# EAGLE design minimallogic (EAGLE 6.6.0)
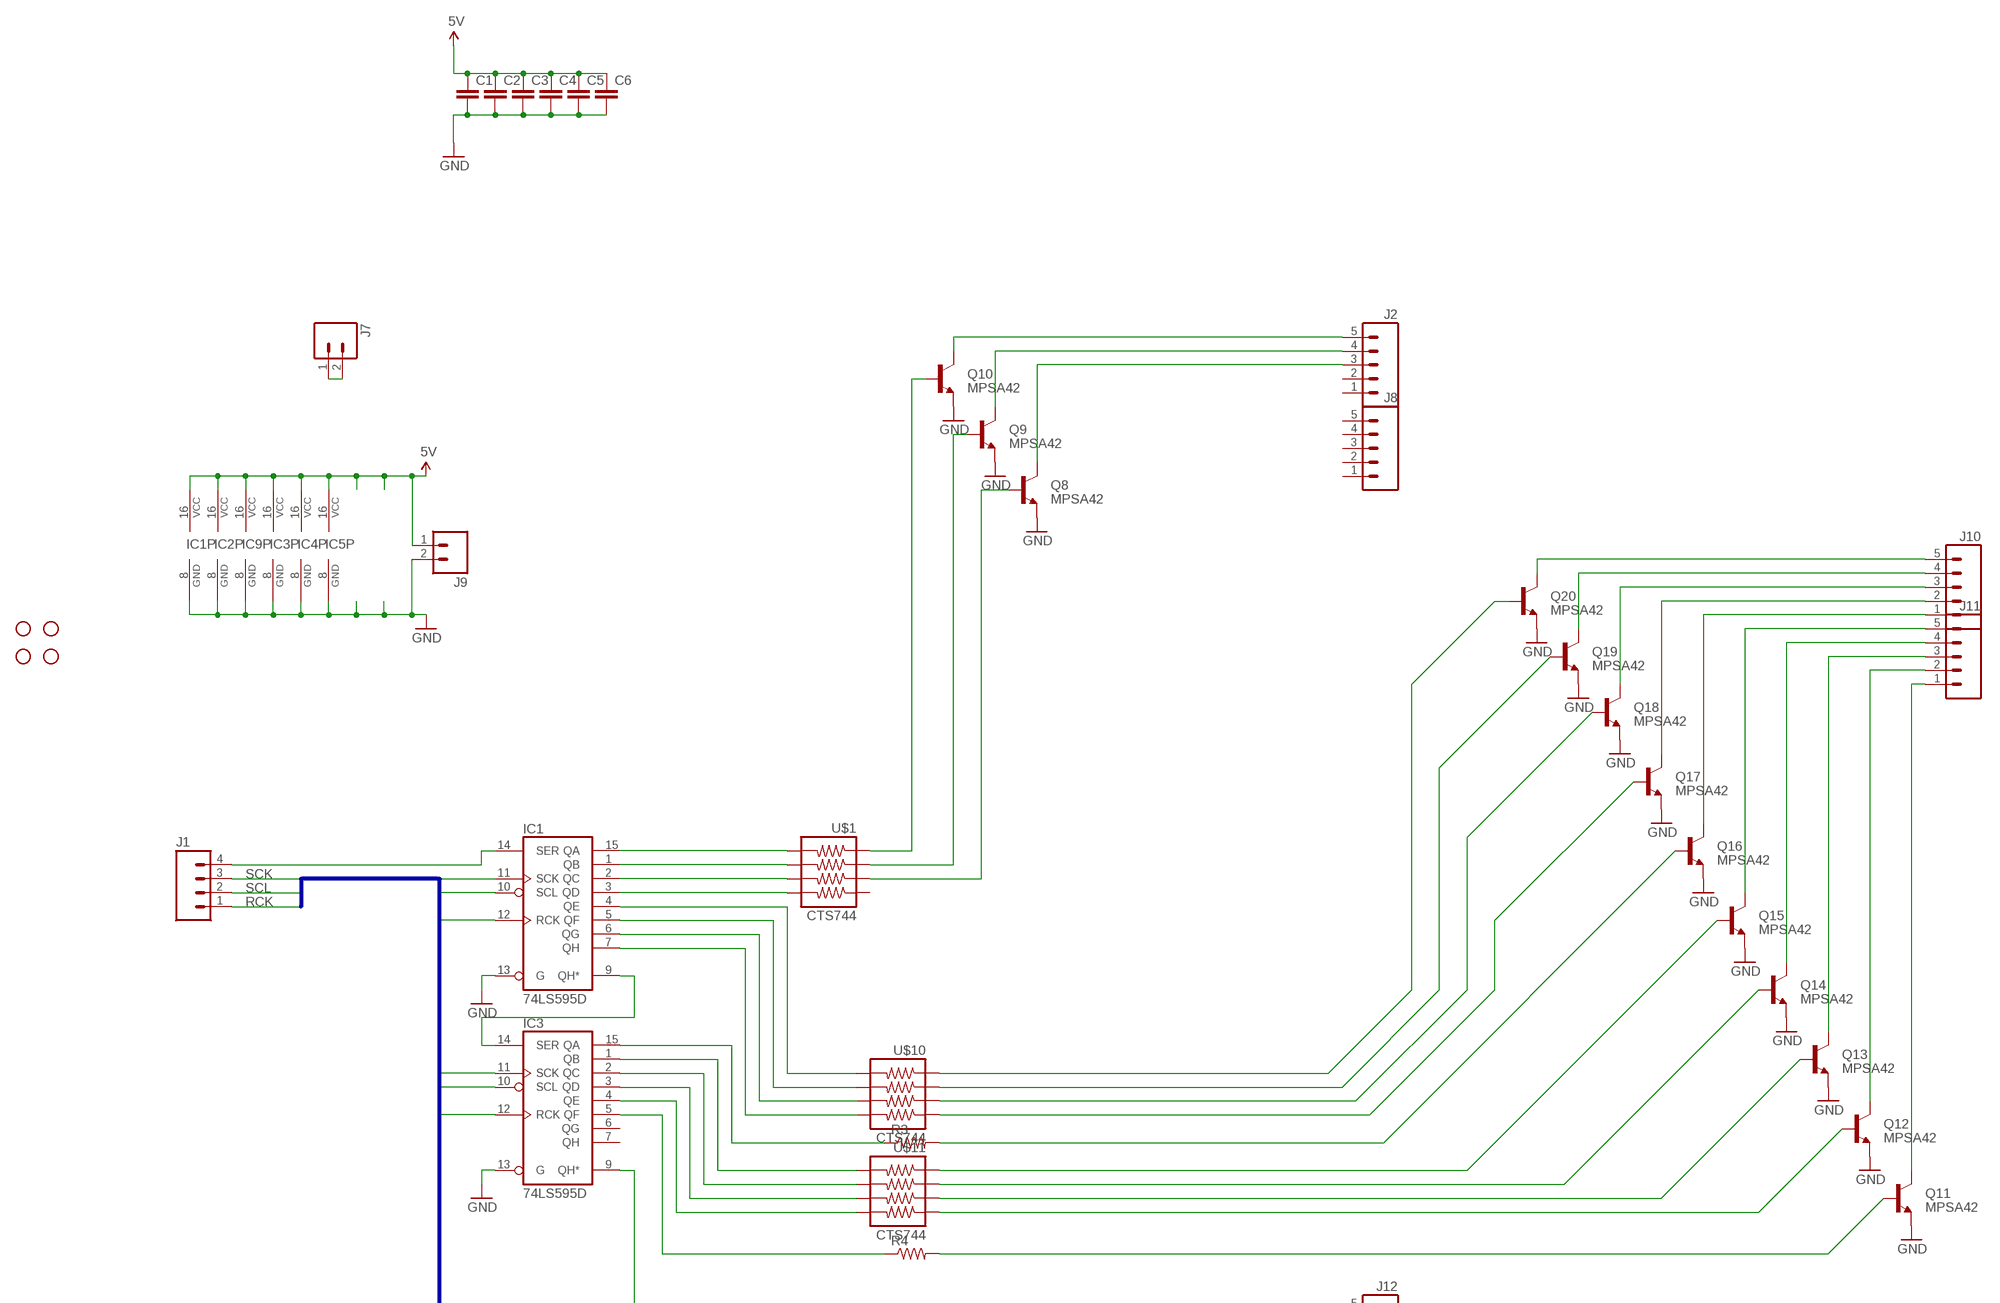
[diagram p0: schematic, sheet 1, part 1 of 2]
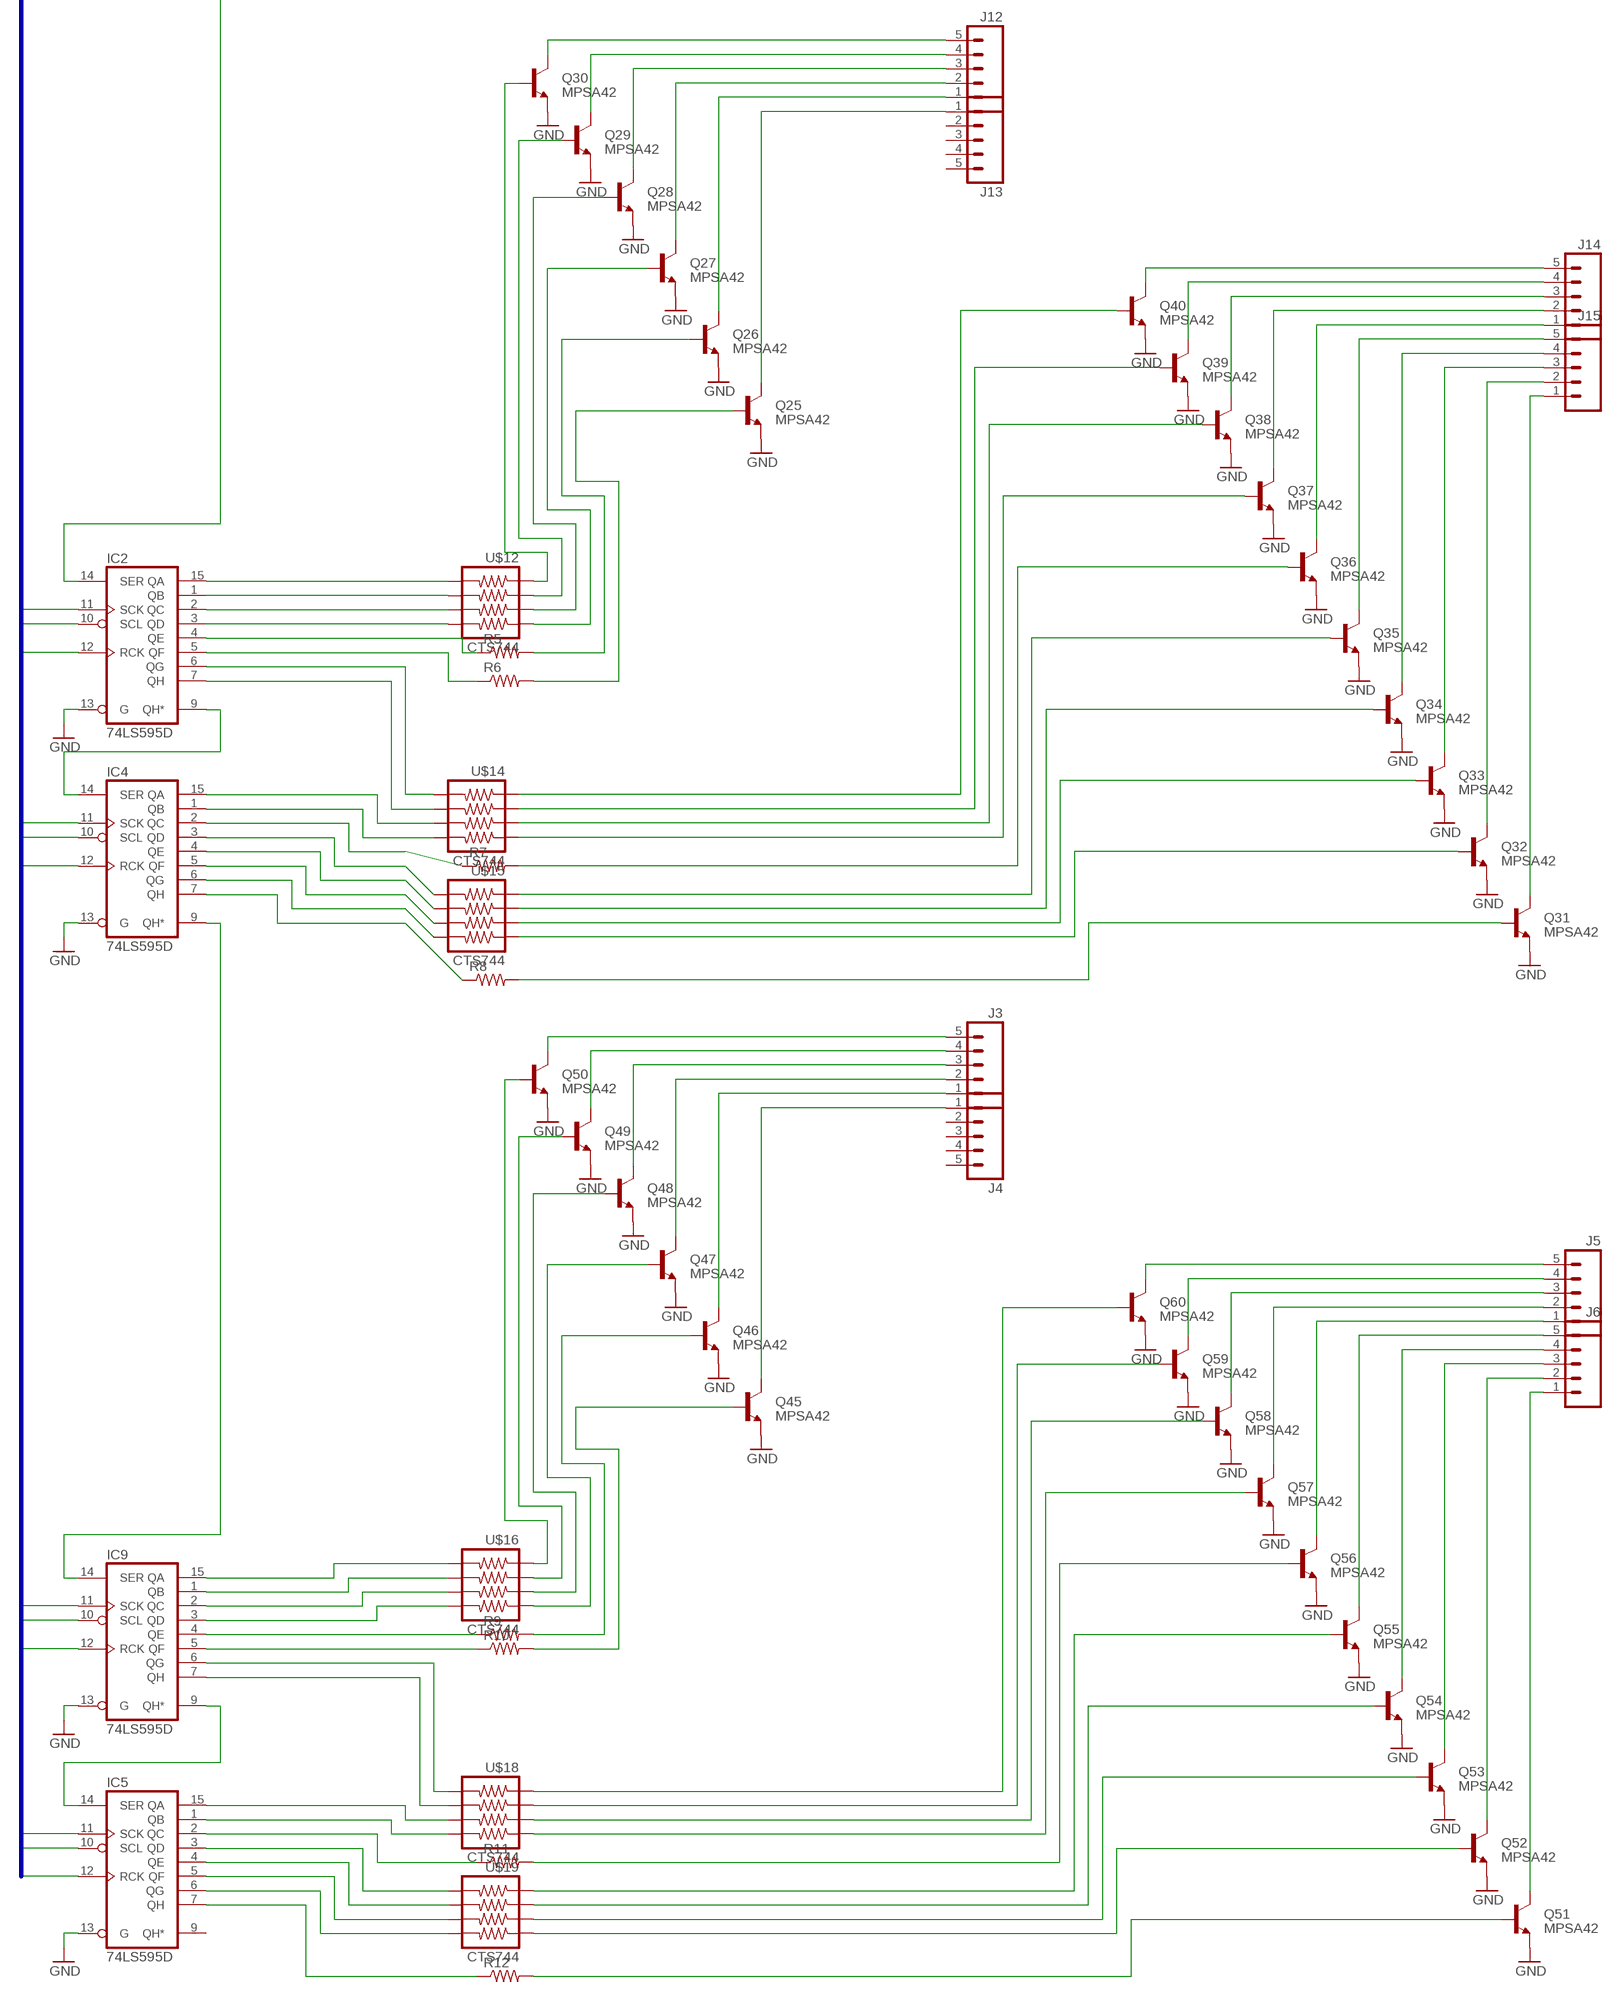
[diagram p1: schematic, sheet 1, part 2 of 2]

## Parts
C1  CAP0805  [0805]
C2  CAP0805  [0805]
C3  CAP0805  [0805]
C4  CAP0805  [0805]
C5  CAP0805  [0805]
C6  CAP0805  [0805]
H1  STAND-OFF  [STAND-OFF]
H2  STAND-OFF  [STAND-OFF]
H3  STAND-OFF  [STAND-OFF]
H4  STAND-OFF  [STAND-OFF]
IC1  74LS595D  [SO16]
IC2  74LS595D  [SO16]
IC3  74LS595D  [SO16]
IC4  74LS595D  [SO16]
IC5  74LS595D  [SO16]
IC9  74LS595D  [SO16]
J1  M04PTH  [1X04]
J2  M05PTH  [1X05]
J3  M05PTH  [1X05]
J4  M05PTH  [1X05]
J5  M05PTH  [1X05]
J6  M05PTH  [1X05]
J7  M02PTH  [1X02]
J8  M05PTH  [1X05]
J9  M02PTH  [1X02]
J10  M05PTH  [1X05]
J11  M05PTH  [1X05]
J12  M05PTH  [1X05]
J13  M05PTH  [1X05]
J14  M05PTH  [1X05]
J15  M05PTH  [1X05]
Q8  MPSA42  TRANSISTOR_NPNMPSA42  [SOT23-3]
Q9  MPSA42  TRANSISTOR_NPNMPSA42  [SOT23-3]
Q10  MPSA42  TRANSISTOR_NPNMPSA42  [SOT23-3]
Q11  MPSA42  TRANSISTOR_NPNMPSA42  [SOT23-3]
Q12  MPSA42  TRANSISTOR_NPNMPSA42  [SOT23-3]
Q13  MPSA42  TRANSISTOR_NPNMPSA42  [SOT23-3]
Q14  MPSA42  TRANSISTOR_NPNMPSA42  [SOT23-3]
Q15  MPSA42  TRANSISTOR_NPNMPSA42  [SOT23-3]
Q16  MPSA42  TRANSISTOR_NPNMPSA42  [SOT23-3]
Q17  MPSA42  TRANSISTOR_NPNMPSA42  [SOT23-3]
Q18  MPSA42  TRANSISTOR_NPNMPSA42  [SOT23-3]
Q19  MPSA42  TRANSISTOR_NPNMPSA42  [SOT23-3]
Q20  MPSA42  TRANSISTOR_NPNMPSA42  [SOT23-3]
Q25  MPSA42  TRANSISTOR_NPNMPSA42  [SOT23-3]
Q26  MPSA42  TRANSISTOR_NPNMPSA42  [SOT23-3]
Q27  MPSA42  TRANSISTOR_NPNMPSA42  [SOT23-3]
Q28  MPSA42  TRANSISTOR_NPNMPSA42  [SOT23-3]
Q29  MPSA42  TRANSISTOR_NPNMPSA42  [SOT23-3]
Q30  MPSA42  TRANSISTOR_NPNMPSA42  [SOT23-3]
Q31  MPSA42  TRANSISTOR_NPNMPSA42  [SOT23-3]
Q32  MPSA42  TRANSISTOR_NPNMPSA42  [SOT23-3]
Q33  MPSA42  TRANSISTOR_NPNMPSA42  [SOT23-3]
Q34  MPSA42  TRANSISTOR_NPNMPSA42  [SOT23-3]
Q35  MPSA42  TRANSISTOR_NPNMPSA42  [SOT23-3]
Q36  MPSA42  TRANSISTOR_NPNMPSA42  [SOT23-3]
Q37  MPSA42  TRANSISTOR_NPNMPSA42  [SOT23-3]
Q38  MPSA42  TRANSISTOR_NPNMPSA42  [SOT23-3]
Q39  MPSA42  TRANSISTOR_NPNMPSA42  [SOT23-3]
Q40  MPSA42  TRANSISTOR_NPNMPSA42  [SOT23-3]
Q45  MPSA42  TRANSISTOR_NPNMPSA42  [SOT23-3]
Q46  MPSA42  TRANSISTOR_NPNMPSA42  [SOT23-3]
Q47  MPSA42  TRANSISTOR_NPNMPSA42  [SOT23-3]
Q48  MPSA42  TRANSISTOR_NPNMPSA42  [SOT23-3]
Q49  MPSA42  TRANSISTOR_NPNMPSA42  [SOT23-3]
Q50  MPSA42  TRANSISTOR_NPNMPSA42  [SOT23-3]
Q51  MPSA42  TRANSISTOR_NPNMPSA42  [SOT23-3]
Q52  MPSA42  TRANSISTOR_NPNMPSA42  [SOT23-3]
Q53  MPSA42  TRANSISTOR_NPNMPSA42  [SOT23-3]
Q54  MPSA42  TRANSISTOR_NPNMPSA42  [SOT23-3]
Q55  MPSA42  TRANSISTOR_NPNMPSA42  [SOT23-3]
Q56  MPSA42  TRANSISTOR_NPNMPSA42  [SOT23-3]
Q57  MPSA42  TRANSISTOR_NPNMPSA42  [SOT23-3]
Q58  MPSA42  TRANSISTOR_NPNMPSA42  [SOT23-3]
Q59  MPSA42  TRANSISTOR_NPNMPSA42  [SOT23-3]
Q60  MPSA42  TRANSISTOR_NPNMPSA42  [SOT23-3]
R3  RESISTOR0805-RES  [0805]
R4  RESISTOR0805-RES  [0805]
R5  RESISTOR0805-RES  [0805]
R6  RESISTOR0805-RES  [0805]
R7  RESISTOR0805-RES  [0805]
R8  RESISTOR0805-RES  [0805]
R9  RESISTOR0805-RES  [0805]
R10  RESISTOR0805-RES  [0805]
R11  RESISTOR0805-RES  [0805]
R12  RESISTOR0805-RES  [0805]
U$1  CTS744  [CT740-746]
U$10  CTS744  [CT740-746]
U$11  CTS744  [CT740-746]
U$12  CTS744  [CT740-746]
U$14  CTS744  [CT740-746]
U$15  CTS744  [CT740-746]
U$16  CTS744  [CT740-746]
U$18  CTS744  [CT740-746]
U$19  CTS744  [CT740-746]

## Nets
5V: C1.1 C2.1 C3.1 C4.1 C5.1 C6.1 IC1.16(VCC) IC2.16(VCC) IC3.16(VCC) IC4.16(VCC) IC5.16(VCC) IC9.16(VCC) J9.1
GND: C1.2 C2.2 C3.2 C4.2 C5.2 C6.2 IC1.8(GND) IC1.13(G) IC2.8(GND) IC2.13(G) IC3.8(GND) IC3.13(G) IC4.8(GND) IC4.13(G) IC5.8(GND) IC5.13(G) IC9.8(GND) IC9.13(G) J9.2 Q8.2(E) Q9.2(E) Q10.2(E) Q11.2(E) Q12.2(E) Q13.2(E) Q14.2(E) Q15.2(E) Q16.2(E) Q17.2(E) Q18.2(E) Q19.2(E) Q20.2(E) Q25.2(E) Q26.2(E) Q27.2(E) Q28.2(E) Q29.2(E) Q30.2(E) Q31.2(E) Q32.2(E) Q33.2(E) Q34.2(E) Q35.2(E) Q36.2(E) Q37.2(E) Q38.2(E) Q39.2(E) Q40.2(E) Q45.2(E) Q46.2(E) Q47.2(E) Q48.2(E) Q49.2(E) Q50.2(E) Q51.2(E) Q52.2(E) Q53.2(E) Q54.2(E) Q55.2(E) Q56.2(E) Q57.2(E) Q58.2(E) Q59.2(E) Q60.2(E)
N$1: IC1.4(QE) U$10.P8(OUT1)
N$2: IC1.5(QF) U$10.P7(OUT2)
N$3: IC1.6(QG) U$10.P6(OUT3)
N$4: IC1.7(QH) U$10.P5(OUT4)
N$5: IC2.5(QF) R6.1
N$6: IC2.4(QE) R5.1
N$7: IC2.9(QH*) IC4.14(SER)
N$8: IC9.15(QA) U$16.P8(OUT1)
N$9: J13.1 Q25.3(C)
N$10: J12.1 Q26.3(C)
N$11: J11.1 Q11.3(C)
N$12: J11.2 Q12.3(C)
N$13: J11.3 Q13.3(C)
N$14: J11.4 Q14.3(C)
N$15: J11.5 Q15.3(C)
N$16: J10.1 Q16.3(C)
N$17: J10.2 Q17.3(C)
N$18: J10.3 Q18.3(C)
N$19: J10.4 Q19.3(C)
N$20: J10.5 Q20.3(C)
N$21: IC1.9(QH*) IC3.14(SER)
N$22: IC1.15(QA) U$1.P8(OUT1)
N$23: IC1.1(QB) U$1.P7(OUT2)
N$24: IC1.2(QC) U$1.P6(OUT3)
N$25: IC1.3(QD) U$1.P5(OUT4)
N$26: IC3.15(QA) R3.1
N$27: IC3.1(QB) U$11.P8(OUT1)
N$28: IC3.2(QC) U$11.P7(OUT2)
N$29: IC3.3(QD) U$11.P6(OUT3)
N$30: IC3.4(QE) U$11.P5(OUT4)
N$31: IC3.5(QF) R4.1
N$32: IC9.1(QB) U$16.P7(OUT2)
N$33: IC9.2(QC) U$16.P6(OUT3)
N$34: IC9.3(QD) U$16.P5(OUT4)
N$35: IC9.4(QE) R9.1
N$36: IC9.5(QF) R10.1
N$37: IC2.15(QA) U$12.P8(OUT1)
N$38: IC2.1(QB) U$12.P7(OUT2)
N$39: IC2.2(QC) U$12.P6(OUT3)
N$40: IC2.3(QD) U$12.P5(OUT4)
N$41: IC5.14(SER) IC9.9(QH*)
N$42: J12.2 Q27.3(C)
N$43: IC4.9(QH*) IC9.14(SER)
N$44: IC9.6(QG) U$18.P8(OUT1)
N$45: IC9.7(QH) U$18.P7(OUT2)
N$46: IC5.15(QA) U$18.P6(OUT3)
N$47: IC2.6(QG) U$14.P8(OUT1)
N$48: IC2.7(QH) U$14.P7(OUT2)
N$49: IC4.15(QA) U$14.P6(OUT3)
N$50: IC4.1(QB) U$14.P5(OUT4)
N$51: IC4.2(QC) R7.1
N$52: IC4.3(QD) U$15.P8(OUT1)
N$53: IC4.4(QE) U$15.P7(OUT2)
N$54: IC4.5(QF) U$15.P6(OUT3)
N$55: IC4.6(QG) U$15.P5(OUT4)
N$56: IC4.7(QH) R8.1
N$57: IC5.1(QB) U$18.P5(OUT4)
N$58: IC5.2(QC) R11.1
N$59: IC5.3(QD) U$19.P8(OUT1)
N$60: IC5.4(QE) U$19.P7(OUT2)
N$61: Q20.1(B) U$10.P1(IN1)
N$62: IC5.5(QF) U$19.P6(OUT3)
N$63: IC5.6(QG) U$19.P5(OUT4)
N$64: IC5.7(QH) R12.1
N$65: J4.1 Q45.3(C)
N$66: J3.1 Q46.3(C)
N$67: J3.2 Q47.3(C)
N$68: J7.1 J7.2
N$69: Q11.1(B) R4.2
N$71: J12.3 Q28.3(C)
N$72: J12.4 Q29.3(C)
N$73: Q12.1(B) U$11.P4(IN4)
N$74: J12.5 Q30.3(C)
N$75: Q13.1(B) U$11.P3(IN3)
N$77: Q14.1(B) U$11.P2(IN2)
N$86: Q15.1(B) U$11.P1(IN1)
N$87: Q16.1(B) R3.2
N$89: Q19.1(B) U$10.P2(IN2)
N$90: Q18.1(B) U$10.P3(IN3)
N$91: Q17.1(B) U$10.P4(IN4)
N$92: Q10.1(B) U$1.P1(IN1)
N$93: Q9.1(B) U$1.P2(IN2)
N$94: Q8.1(B) U$1.P3(IN3)
N$98: J15.1 Q31.3(C)
N$99: J15.2 Q32.3(C)
N$100: J15.3 Q33.3(C)
N$101: J15.4 Q34.3(C)
N$102: J15.5 Q35.3(C)
N$103: J14.1 Q36.3(C)
N$104: J14.2 Q37.3(C)
N$105: J14.3 Q38.3(C)
N$106: J14.4 Q39.3(C)
N$107: J14.5 Q40.3(C)
N$111: Q30.1(B) U$12.P1(IN1)
N$112: Q29.1(B) U$12.P2(IN2)
N$113: Q28.1(B) U$12.P3(IN3)
N$114: Q27.1(B) U$12.P4(IN4)
N$115: Q26.1(B) R5.2
N$116: Q25.1(B) R6.2
N$144: IC2.14(SER) IC3.9(QH*)
N$152: J2.3 Q8.3(C)
N$153: J2.4 Q9.3(C)
N$154: J2.5 Q10.3(C)
N$157: Q40.1(B) U$14.P1(IN1)
N$158: Q39.1(B) U$14.P2(IN2)
N$159: Q38.1(B) U$14.P3(IN3)
N$160: Q37.1(B) U$14.P4(IN4)
N$161: Q36.1(B) R7.2
N$162: Q35.1(B) U$15.P1(IN1)
N$163: Q34.1(B) U$15.P2(IN2)
N$164: Q33.1(B) U$15.P3(IN3)
N$165: Q32.1(B) U$15.P4(IN4)
N$166: Q31.1(B) R8.2
N$167: Q50.1(B) U$16.P1(IN1)
N$168: Q49.1(B) U$16.P2(IN2)
N$169: Q48.1(B) U$16.P3(IN3)
N$170: Q47.1(B) U$16.P4(IN4)
N$171: Q46.1(B) R9.2
N$172: Q45.1(B) R10.2
N$177: Q60.1(B) U$18.P1(IN1)
N$178: Q59.1(B) U$18.P2(IN2)
N$179: Q58.1(B) U$18.P3(IN3)
N$180: Q57.1(B) U$18.P4(IN4)
N$181: Q56.1(B) R11.2
N$182: Q55.1(B) U$19.P1(IN1)
N$183: Q54.1(B) U$19.P2(IN2)
N$184: Q53.1(B) U$19.P3(IN3)
N$185: Q52.1(B) U$19.P4(IN4)
N$186: Q51.1(B) R12.2
N$187: IC1.14(SER) J1.4
N$198: J3.3 Q48.3(C)
N$199: J3.4 Q49.3(C)
N$200: J3.5 Q50.3(C)
N$221: J6.1 Q51.3(C)
N$222: J6.2 Q52.3(C)
N$223: J6.3 Q53.3(C)
N$224: J6.4 Q54.3(C)
N$225: J6.5 Q55.3(C)
N$226: J5.1 Q56.3(C)
N$227: J5.2 Q57.3(C)
N$228: J5.3 Q58.3(C)
N$229: J5.4 Q59.3(C)
N$230: J5.5 Q60.3(C)
RCK: IC1.12(RCK) IC2.12(RCK) IC3.12(RCK) IC4.12(RCK) IC5.12(RCK) IC9.12(RCK) J1.1
SCK: IC1.11(SCK) IC2.11(SCK) IC3.11(SCK) IC4.11(SCK) IC5.11(SCK) IC9.11(SCK) J1.3
SCL: IC1.10(SCL) IC2.10(SCL) IC3.10(SCL) IC4.10(SCL) IC5.10(SCL) IC9.10(SCL) J1.2
Unconnected: IC3.6(QG) IC3.7(QH) IC5.9(QH*) J2.1 J2.2 J4.2 J4.3 J4.4 J4.5 J8.1 J8.2 J8.3 J8.4 J8.5 J13.2 J13.3 J13.4 J13.5 U$1.P4(IN4)

## Buses
SCK,SCL,RCK

## Library data of the parts
C1-C6 = SparkFun-Capacitors:CAP: Capacitor Standard 0603 ceramic capacitor, and 0.1" leaded capacitor.
H1-H4 = SparkFun-Electromechanical:STAND-OFF: #4 Stand Off This is the mechanical footprint for a #4 phillips button head screw. Use the keepout ring to avoid running the screw head into surrounding components. SKU : PRT-00447
IC1-IC5 IC9 = 74xx-us:74*595: 8-bit SHIFT REGISTER, output latch
J1 = SparkFun-Connectors:M04: Header 4 Standard 4-pin 0.1" header. Use with straight break away headers (SKU : PRT-00116), right angle break away headers (PRT-00553), swiss pins (PRT-00743), machine pins (PRT-00117), and female headers (PRT-00115). Molex polarized connector foot print use with SKU : PRT-08231 with associated crimp pins and housings. 1MM SMD Version SKU: PRT-10208; PROD_ID: CONN-09696
J2-J6 J8 J10-J15 = SparkFun-Connectors:M05: Header 5 Standard 5-pin 0.1" header. Use with straight break away headers (SKU : PRT-00116), right angle break away headers (PRT-00553), swiss pins (PRT-00743), machine pins (PRT-00117), and female headers (PRT-00115). Molex polarized connector foot print use with SKU : PRT-08230 with associated crimp pins and housings.
J7 J9 = SparkFun-Connectors:M02: Standard 2-pin 0.1" header. Use with - straight break away headers ( PRT-00116) - right angle break away headers (PRT-00553) - swiss pins (PRT-00743) - machine pins (PRT-00117) - female headers (PRT-00115) Molex polarized connector foot print use with: PRT-08233 with associated crimp pins and housings. 2.54_SCREWTERM for use with PRT-10571. 3.5mm Screw Terminal footprints for PRT-08084 5mm Screw Terminal footprints for use with PRT-08432
Q8-Q20 Q25-Q40 Q45-Q60 = SparkFun-DiscreteSemi:TRANSISTOR_NPN: Generic NPN BJT MMBT2222A - TRANS-08049 (SOT-23, 1A 40V) MPSA42 - TRANS-09116 (SOT-23, 500mA 300V) MMBT5088LT1G - TRANS-11160 (SOT-23, 50 mA 30V) BC547 - COM-08928 <http://www.sparkfun.com/products/8928> (TO-92 45V 100mA) (1.Collector 2.Base 3.Emitter) 2N3904 - COM-00521 <http://www.sparkfun.com/products/521> (TO-92 40V 200mA) (1.Emitter 2.Base 3.Collector) P2N2222A - COM-12852 <http://www.sparkfun.com/products/12852> (TO-92 40V 600mA) (1.Collector 2.Base 3.Emitter); PROD_ID: TRANS-09116
R3-R12 = SparkFun-Passives:RESISTOR: Resistor Basic schematic elements and footprints for 0603, 1206, and PTH resistors.
U$1 U$10-U$12 U$14-U$16 U$18 U$19 = SparkFun-Passives:CTS744

## Board
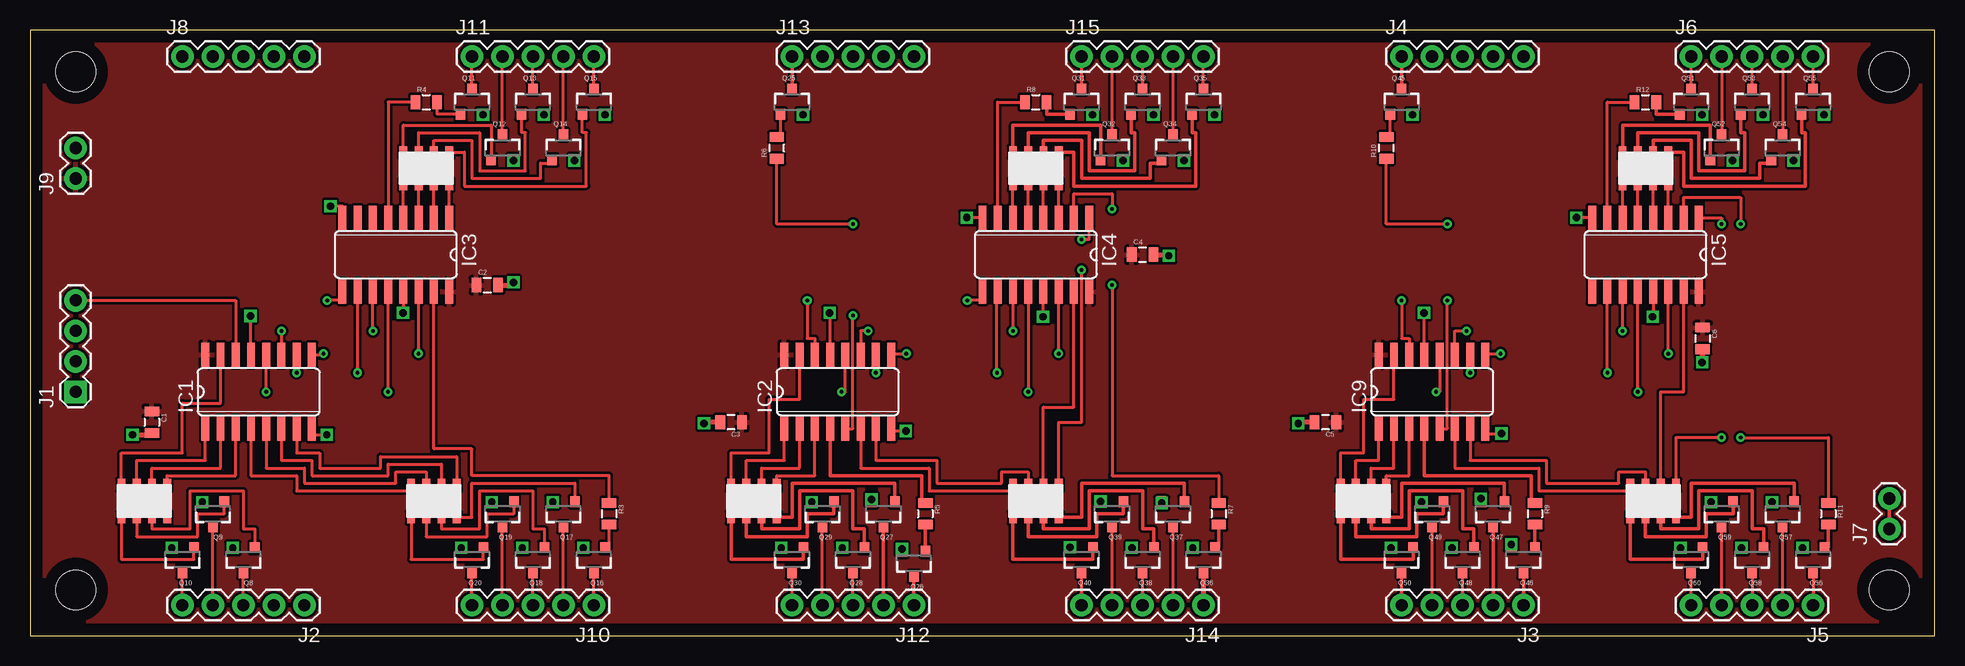
[diagram p2: board, top side]
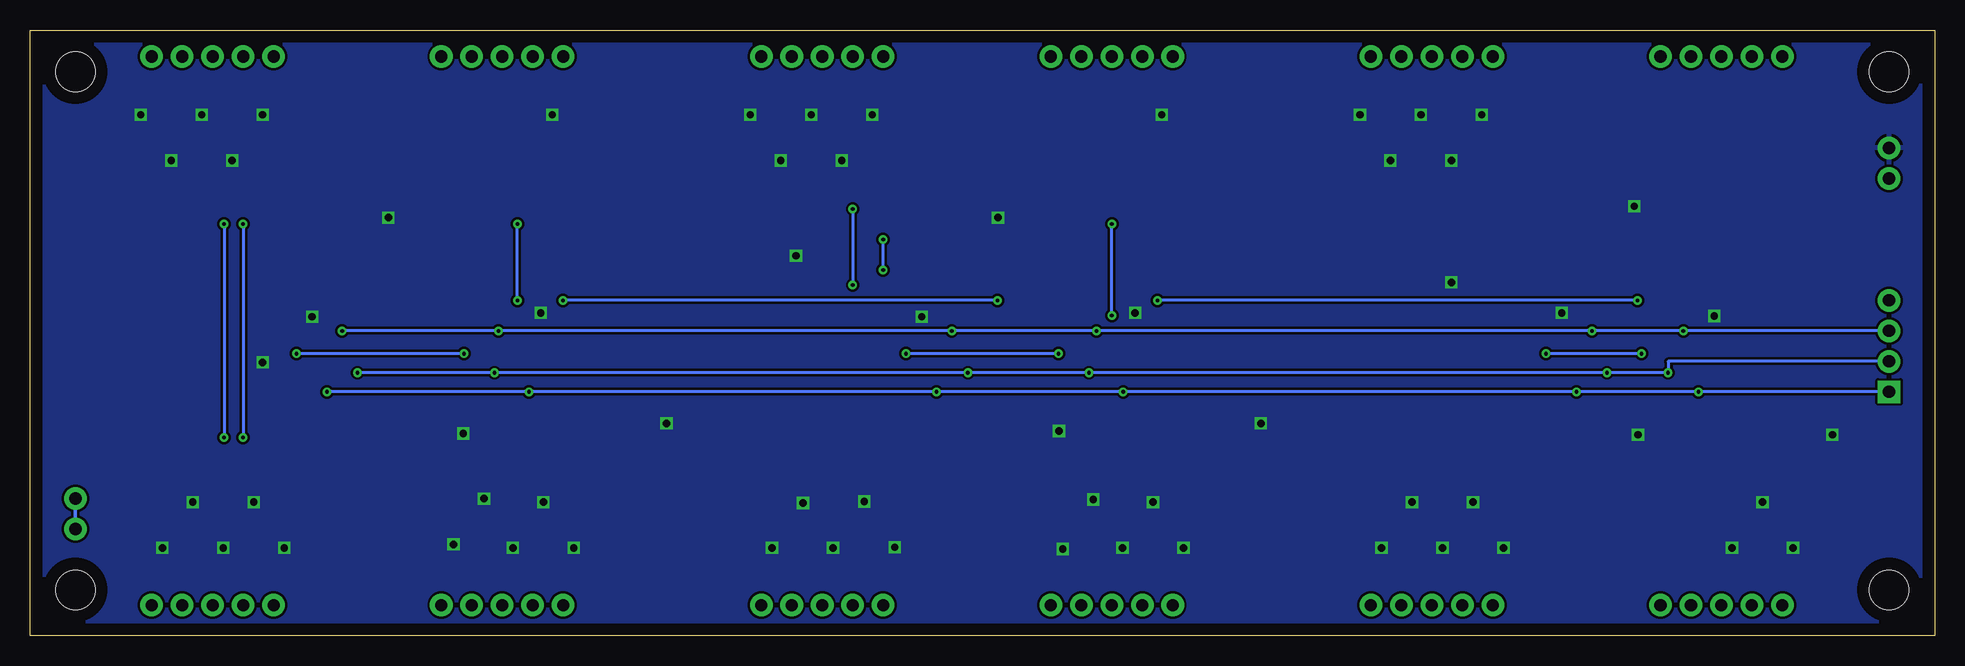
[diagram p3: board, bottom side, seen from below]

Size 158.73 x 50.47 mm. Coordinates in mm from the lower left corner, seen from the top.
Outline: 0,0 158.73,0 158.73,50.47 0,50.47 0,0
Copper layers (1*16): Top 0.035mm / dielectric 1.5mm / Bottom 0.035mm
Design rules "default *": minimum track width 10mil, minimum drill 12mil, track to track 8mil, track to pad 8mil, pad to pad 8mil, via to via 8mil, smd to smd 8mil, copper to edge 40mil, drill to drill 8mil, minimum pad ring 10mil, minimum via ring 8mil, stop-mask expansion 4mil, vias tented up to drill 0mil, thermal gap 10mil

### Footprints (pad centres in the part's own frame; a part is rotated, then mirrored left to right if it is on the bottom)
0805 = smd 0.8 x 1.2: 1 -0.9,0; 2 0.9,0
STAND-OFF = hole 3.302: 0,0
SO16 = smd 0.66 x 2.032: 1 -4.445,-3.073; 2 -3.175,-3.073; 3 -1.905,-3.073; 4 -0.635,-3.073; 5 0.635,-3.073; 6 1.905,-3.073; 7 3.175,-3.073; 8 4.445,-3.073; 9 4.445,3.073; 10 3.175,3.073; 11 1.905,3.073; 12 0.635,3.073; 13 -0.635,3.073; 14 -1.905,3.073; 15 -3.175,3.073; 16 -4.445,3.073
1X04 = drill 1.016 pad 1.88 square: 1 0,0 | drill 1.016 pad 1.88: 2 2.54,0; 3 5.08,0; 4 7.62,0
1X05 = drill 1.016 pad 1.88: 1 0,0; 2 2.54,0; 3 5.08,0; 4 7.62,0; 5 10.16,0
1X02 = drill 1.016 pad 1.88: 1 0,0; 2 2.54,0
SOT23-3 = smd 0.8 x 0.9: 1 -0.95,-1; 2 0.95,-1; 3 0,1.1
CT740-746 = smd 0.65 x 1: P1 0,-2.2; P2 1.27,-2.2; P3 2.54,-2.2; P4 3.81,-2.2; P5 3.81,0.5; P6 2.54,0.5; P7 1.27,0.5; P8 0,0.5

### Placement (x,y rotation side)
C1  10.16,17.78 270 top
C2  38.1,29.21 0 top
C3  58.42,17.78 180 top
C4  92.71,31.75 0 top
C5  107.95,17.78 180 top
C6  139.38,24.77 270 top
H1  3.81,3.81 0 top
H2  154.94,46.99 0 top
H3  154.94,3.81 0 top
H4  3.81,46.99 0 top
IC1  19.05,20.32 0 top
IC2  67.31,20.32 0 top
IC3  30.48,31.75 180 top
IC4  83.82,31.75 180 top
IC5  134.62,31.75 180 top
IC9  116.84,20.32 0 top
J1  3.81,20.32 90 top
J2  22.86,2.54 180 top
J3  124.46,2.54 180 top
J4  114.3,48.26 0 top
J5  148.59,2.54 180 top
J6  138.43,48.26 0 top
J7  154.94,8.89 90 top
J8  12.7,48.26 0 top
J9  3.81,38.1 90 top
J10  46.99,2.54 180 top
J11  36.83,48.26 0 top
J12  73.66,2.54 180 top
J13  63.5,48.26 0 top
J14  97.79,2.54 180 top
J15  87.63,48.26 0 top
Q8  17.78,6.35 180 top
Q9  15.24,10.16 180 top
Q10  12.7,6.35 180 top
Q11  36.83,44.45 0 top
Q12  39.37,40.64 0 top
Q13  41.91,44.45 0 top
Q14  44.45,40.64 0 top
Q15  46.99,44.45 0 top
Q16  46.99,6.35 180 top
Q17  44.45,10.16 180 top
Q18  41.91,6.35 180 top
Q19  39.37,10.16 180 top
Q20  36.83,6.35 180 top
Q25  63.5,44.45 0 top
Q26  73.66,6.03 180 top
Q27  71.12,10.16 180 top
Q28  68.58,6.35 180 top
Q29  66.04,10.16 180 top
Q30  63.5,6.35 180 top
Q31  87.63,44.45 0 top
Q32  90.17,40.64 0 top
Q33  92.71,44.45 0 top
Q34  95.25,40.64 0 top
Q35  97.79,44.45 0 top
Q36  97.79,6.35 180 top
Q37  95.25,10.16 180 top
Q38  92.71,6.35 180 top
Q39  90.17,10.16 180 top
Q40  87.63,6.35 180 top
Q45  114.3,44.45 0 top
Q46  124.46,6.35 180 top
Q47  121.92,10.16 180 top
Q48  119.38,6.35 180 top
Q49  116.84,10.16 180 top
Q50  114.3,6.35 180 top
Q51  138.43,44.45 0 top
Q52  140.97,40.64 0 top
Q53  143.51,44.45 0 top
Q54  146.05,40.64 0 top
Q55  148.59,44.45 0 top
Q56  148.59,6.35 180 top
Q57  146.05,10.16 180 top
Q58  143.51,6.35 180 top
Q59  140.97,10.16 180 top
Q60  138.43,6.35 180 top
R3  48.26,10.16 270 top
R4  33.02,44.45 0 top
R5  74.61,10.16 270 top
R6  62.23,40.64 90 top
R7  99.06,10.16 270 top
R8  83.82,44.45 0 top
R9  125.41,10.16 270 top
R10  113.03,40.64 90 top
R11  149.86,10.16 270 top
R12  134.62,44.45 0 top
U$1  7.62,12.06 0 top
U$10  31.75,12.06 0 top
U$11  34.92,38.1 180 top
U$12  58.42,12.06 0 top
U$14  81.92,12.06 0 top
U$15  85.73,38.1 180 top
U$16  109.22,12.06 0 top
U$18  133.35,12.06 0 top
U$19  136.53,38.1 180 top

### Tracks (layer width: path | path; a pad name or v marks a point on that pad's centre or on a via)
5V
  pour Top: 0,0 158.75,0 158.75,50.8 0,50.8
GND  (via drill 0.61)
  Top 0.254: IC1.8 23.49,16.74 v24.73,16.74 | IC1.13 18.41,26.63 v18.38,26.63 | IC2.8 71.75,17.06 v72.99,17.06 | IC2.13 66.67,26.9 v66.64,26.9 | IC9.8 121.28,16.84 v122.62,16.84 | IC3.13 31.11,26.9 v31.08,26.9 | IC3.8 26.04,35.79 v25.04,35.79 | IC9.13 116.2,26.9 v116.17,26.9 | IC5.13 135.25,26.58 v135.22,26.58 | IC5.8 128.87,34.82 v128.87,34.84 | v84.42,26.58 84.45,26.58 IC4.13 | v64.41,43.41 64.45,43.41 Q25.2 | Q45.2 115.21,43.45 v115.21,43.41 | IC4.8 78.07,34.82 v78.07,34.84
  Top 0.305: Q39.2 89.2,11.16 v89.2,11.18 | v94.31,11.05 v94.3,11.05 Q37.2 | v91.82,7.32 91.76,7.32 Q38.2 | Q40.2 86.67,7.35 v86.67,7.37 | v96.9,7.32 96.84,7.32 Q36.2 | v67.69,7.32 67.63,7.32 Q28.2 | v65.15,11.12 65.09,11.12 Q29.2 | Q30.2 62.61,7.35 v62.61,7.32 | v46.1,7.32 46.04,7.32 Q16.2 | v43.56,11.12 43.5,11.12 Q17.2 | v41.02,7.32 40.96,7.32 Q18.2 | v38.48,11.12 38.42,11.12 Q19.2 | v35.94,7.32 35.88,7.32 Q20.2 | v16.89,7.32 16.83,7.32 Q8.2 | v14.35,11.12 14.29,11.12 Q9.2 | v11.81,7.32 11.75,7.32 Q10.2 | Q26.2 72.71,7.21 v72.67,7.21 | Q27.2 70.17,11.34 v70.13,11.34 | Q46.2 123.51,7.61 v123.44,7.61 | v118.49,7.32 118.49,7.35 Q48.2 | v113.41,7.32 113.41,7.35 Q50.2 | v115.95,11.12 115.95,11.16 Q49.2 | Q47.2 120.97,11.42 v120.9,11.42 | v149.5,43.41 149.5,43.45 Q55.2 | Q53.2 144.46,43.41 v144.42,43.41 | Q54.2 147,39.6 v146.96,39.6 | v139.34,43.41 139.34,43.45 Q51.2 | v141.88,39.6 141.88,39.64 Q52.2 | Q57.2 145.1,11.12 v145.16,11.12 | Q56.2 147.64,7.32 v147.7,7.32 | v140.08,11.12 140.08,11.16 Q59.2 | Q58.2 142.56,7.32 v142.62,7.32 | v98.7,43.41 98.7,43.45 Q35.2 | v137.54,7.32 137.54,7.35 Q60.2 | v93.62,43.41 93.62,43.45 Q33.2 | v96.16,39.6 96.16,39.64 Q34.2 | v88.54,43.41 88.54,43.45 Q31.2 | v91.08,39.6 91.08,39.64 Q32.2 | v47.9,43.41 47.9,43.45 Q15.2 | v42.82,43.41 42.82,43.45 Q13.2 | Q14.2 45.4,39.6 v45.36,39.6 | v40.28,39.6 40.28,39.64 Q12.2 | v37.74,43.41 37.74,43.45 Q11.2
  Top 0.406: v8.53,16.74 10.16,16.74 C1.2 | C2.2 40.28,29.21 v40.28,29.44 | C3.2 56.16,17.78 v56.16,17.69 | C4.2 94.89,31.75 v94.89,31.66 | C5.2 105.69,17.78 v105.69,17.69 | C6.2 139.34,23.86 v139.34,22.77
  pour Bottom: 0,0 158.75,0 158.75,50.8 0,50.8
N$1
  Top 0.254: IC1.4 18.41,13.34 22.22,13.34 22.22,12.06 31.75,12.06 U$10.P8
N$2
  Top 0.254: IC1.5 19.68,13.97 22.86,13.97 22.86,12.7 30.48,12.7 30.48,13.65 33.02,13.65 U$10.P7
N$3
  Top 0.254: IC1.6 20.95,14.61 23.49,14.61 23.49,13.34 29.84,13.34 29.84,14.29 34.29,14.29 U$10.P6
N$4
  Top 0.254: IC1.7 22.22,15.24 24.13,15.24 24.13,13.97 29.21,13.97 29.21,14.92 35.56,14.92 U$10.P5
N$5  (via drill 0.3)
  Top 0.254: IC2.5 68.58,17.25 v68.58,26.67 | v68.58,34.29 62.23,34.29 R6.1
  Bottom 0.254: v68.58,26.67 v68.58,34.29
N$6
  Top 0.305: IC2.4 66.67,13.34 74.3,13.34 74.3,11.06 R5.1
N$7  (via drill 0.3)
  Top 0.254: IC2.9 71.75,23.5 v73.03,23.5 | v85.73,23.5 IC4.14
  Bottom 0.254: v73.03,23.5 v85.73,23.5
N$8
  Top 0.254: U$16.P8 109.22,15.24 111.12,15.24 111.12,19.68 113.67,19.68 IC9.15
N$9
  Top 0.305: Q25.3 J13.1
N$10
  Top 0.305: J12.1 Q26.3
N$11
  Top 0.254: Q11.3 J11.1
N$12
  Top 0.254: Q12.3 J11.2
N$13
  Top 0.254: Q13.3 J11.3
N$14
  Top 0.254: Q14.3 J11.4
N$15
  Top 0.254: Q15.3 J11.5
N$16
  Top 0.254: J10.1 Q16.3
N$17
  Top 0.254: J10.2 Q17.3
N$18
  Top 0.254: J10.3 Q18.3
N$19
  Top 0.254: J10.4 Q19.3
N$20
  Top 0.254: J10.5 Q20.3
N$21  (via drill 0.3)
  Top 0.254: IC1.9 24.45,23.39 v24.45,23.5 | v32.38,23.5 IC3.14
  Bottom 0.254: v24.45,23.5 v32.38,23.5
N$22
  Top 0.254: U$1.P8 7.62,15.24 12.7,15.24 12.7,19.37 15.88,19.37 IC1.15
N$23
  Top 0.254: U$1.P7 8.89,14.61 14.61,14.61 IC1.1
N$24
  Top 0.254: U$1.P6 10.16,13.97 15.88,13.97 IC1.2
N$25
  Top 0.254: U$1.P5 11.43,13.34 17.14,13.34 IC1.3
N$26
  Top 0.254: R3.1 48.26,13.34 36.83,13.34 36.83,15.56 33.66,15.56 IC3.15
N$27
  Top 0.254: IC3.1 U$11.P8
N$28
  Top 0.254: IC3.2 U$11.P7
N$29
  Top 0.254: IC3.3 U$11.P6
N$30
  Top 0.254: IC3.4 U$11.P5
N$31
  Top 0.254: R4.1 29.84,44.45 IC3.5
N$32
  Top 0.254: U$16.P7 110.49,14.61 112.39,14.61 IC9.1
N$33
  Top 0.254: U$16.P6 111.76,13.97 113.67,13.97 IC9.2
N$34
  Top 0.254: U$16.P5 113.03,13.34 114.94,13.34 IC9.3
N$35
  Top 0.305: IC9.4 116.2,13.34 125.09,13.34 125.09,11.06 R9.1
N$36  (via drill 0.3)
  Top 0.254: IC9.5 118.11,17.25 v118.11,27.94 | v118.11,34.29 113.03,34.29 R10.1
  Bottom 0.254: v118.11,27.94 v118.11,34.29
N$37
  Top 0.254: U$12.P8 58.42,15.24 61.59,15.24 61.59,19.68 64.14,19.68 IC2.15
N$38
  Top 0.254: U$12.P7 59.69,14.61 62.87,14.61 IC2.1
N$39
  Top 0.254: U$12.P6 60.96,13.97 64.14,13.97 IC2.2
N$40
  Top 0.254: U$12.P5 62.23,13.34 65.41,13.34 IC2.3
N$41  (via drill 0.3)
  Top 0.254: IC9.9 121.28,23.5 v122.56,23.5 | v136.53,23.5 IC5.14
  Bottom 0.254: v122.56,23.5 v136.53,23.5
N$42
  Top 0.305: Q27.3 J12.2
N$43  (via drill 0.3)
  Top 0.254: IC4.9 79.38,27.94 v78.11,27.94 | v114.3,27.94 114.3,24.77 114.94,24.77 IC9.14
  Bottom 0.254: v78.11,27.94 v114.3,27.94
N$44
  Top 0.254: IC9.6 118.75,13.97 125.73,13.97 125.73,12.06 133.35,12.06 U$18.P8
N$45
  Top 0.254: IC9.7 120.02,14.61 126.37,14.61 126.37,12.7 132.4,12.7 132.4,13.65 134.62,13.65 U$18.P7
N$46
  Top 0.254: U$18.P6 135.89,20.32 137.8,20.32 IC5.15
N$47
  Top 0.254: IC2.6 69.22,13.97 74.93,13.97 74.93,12.06 81.92,12.06 U$14.P8
N$48
  Top 0.254: IC2.7 70.48,14.61 75.56,14.61 75.56,12.7 80.96,12.7 80.96,13.65 83.19,13.65 U$14.P7
N$49
  Top 0.254: U$14.P6 84.45,19.05 87,19.05 IC4.15
N$50  (via drill 0.3)
  Top 0.254: U$14.P5 85.73,17.78 87.63,17.78 v87.63,30.48 | v87.63,33.02 88.27,33.02 IC4.1
  Bottom 0.254: v87.63,30.48 v87.63,33.02
N$51  (via drill 0.3)
  Top 0.254: IC4.2 87,36.83 90.17,36.83 v90.17,35.56 | v90.17,29.21 90.17,13.34 99.06,13.34 R7.1
  Bottom 0.254: v90.17,35.56 v90.17,29.21
N$52
  Top 0.254: IC4.3 U$15.P8
N$53
  Top 0.254: IC4.4 U$15.P7
N$54
  Top 0.254: IC4.5 U$15.P6
N$55
  Top 0.254: IC4.6 U$15.P5
N$56
  Top 0.254: IC4.7 80.64,44.45 R8.1
N$57  (via drill 0.3)
  Top 0.254: IC5.1 140.97,34.82 v140.97,34.29 | v140.97,16.51 137.16,16.51 U$18.P5
  Bottom 0.254: v140.97,34.29 v140.97,16.51
N$58  (via drill 0.3)
  Top 0.254: IC5.2 137.8,36.51 142.56,36.51 v142.56,34.29 | v142.56,16.51 149.86,16.51 R11.1
  Bottom 0.254: v142.56,34.29 v142.56,16.51
N$59
  Top 0.254: IC5.3 U$19.P8
N$60
  Top 0.254: IC5.4 U$19.P7
N$61
  Top 0.254: U$10.P1 31.75,6.35 37.78,6.35 Q20.1
N$62
  Top 0.254: IC5.5 U$19.P6
N$63
  Top 0.254: IC5.6 U$19.P5
N$64
  Top 0.254: IC5.7 131.44,44.45 R12.1
N$65
  Top 0.305: Q45.3 J4.1
N$66
  Top 0.305: J3.1 Q46.3
N$67
  Top 0.305: Q47.3 J3.2
N$68
  Top 0.305: J7.1 J7.2
  Bottom 0.305: J7.2 J7.1
N$69
  Top 0.254: Q11.1 33.92,43.45 R4.2
N$71
  Top 0.254: J12.3 Q28.3
N$72
  Top 0.254: J12.4 Q29.3
N$73
  Top 0.254: U$11.P4 31.11,42.55 38.42,42.55 Q12.1
N$74
  Top 0.254: J12.5 Q30.3
N$75
  Top 0.254: U$11.P3 32.38,41.91 37.47,41.91 37.47,38.73 41.28,38.73 41.28,41.91 40.96,41.91 Q13.1
N$77
  Top 0.254: U$11.P2 33.66,41.27 36.83,41.27 36.83,38.1 42.55,38.1 42.55,39.37 43.5,39.37 Q14.1
N$86
  Top 0.254: U$11.P1 36.2,40.3 36.2,37.47 46.36,37.47 46.36,41.91 46.04,41.91 Q15.1
N$87
  Top 0.254: Q16.1 48.26,7.35 R3.2
N$89
  Top 0.254: U$10.P2 33.02,8.26 38.1,8.26 38.1,10.16 40.32,10.16 Q19.1
N$90
  Top 0.254: U$10.P3 34.29,8.89 37.47,8.89 37.47,12.06 41.91,12.06 41.91,8.89 42.86,8.89 Q18.1
N$91
  Top 0.254: U$10.P4 36.83,9.87 36.83,12.7 45.4,12.7 Q17.1
N$92
  Top 0.254: U$1.P1 7.62,6.35 13.65,6.35 Q10.1
N$93
  Top 0.254: U$1.P2 8.89,8.26 13.97,8.26 13.97,10.16 16.19,10.16 Q9.1
N$94
  Top 0.254: U$1.P3 10.16,8.89 13.34,8.89 13.34,12.06 17.78,12.06 17.78,8.89 18.73,8.89 Q8.1
N$98
  Top 0.254: Q31.3 J15.1
N$99
  Top 0.254: Q32.3 J15.2
N$100
  Top 0.254: Q33.3 J15.3
N$101
  Top 0.254: Q34.3 J15.4
N$102
  Top 0.254: Q35.3 J15.5
N$103
  Top 0.406: Q36.3 97.79,3.98 J14.1
N$104
  Top 0.254: J14.2 Q37.3
N$105
  Top 0.254: J14.3 Q38.3
N$106
  Top 0.254: J14.4 Q39.3
N$107
  Top 0.254: J14.5 Q40.3
N$111
  Top 0.305: U$12.P1 58.42,6.35 64.45,6.35 Q30.1
N$112
  Top 0.305: U$12.P2 59.69,8.26 64.77,8.26 64.77,10.16 66.99,10.16 Q29.1
N$113
  Top 0.305: U$12.P3 60.96,8.89 64.14,8.89 64.14,12.06 68.58,12.06 68.58,8.89 69.53,8.89 Q28.1
N$114
  Top 0.305: U$12.P4 63.5,9.87 63.5,12.7 72.07,12.7 Q27.1
N$115
  Top 0.305: Q26.1 R5.2
N$116
  Top 0.254: R6.2 62.55,41.54 Q25.1
N$144  (via drill 0.3)
  Top 0.254: IC3.9 26.04,27.94 v24.76,27.94 | v64.77,27.94 64.77,24.77 65.41,24.77 IC2.14
  Bottom 0.254: v24.76,27.94 v64.77,27.94
N$152
  Top 0.254: J2.3 Q8.3
N$153
  Top 0.254: J2.4 Q9.3
N$154
  Top 0.254: J2.5 Q10.3
N$157
  Top 0.305: U$14.P1 81.92,6.35 88.58,6.35 Q40.1
N$158
  Top 0.305: U$14.P2 83.19,8.26 88.9,8.26 88.9,10.16 91.12,10.16 Q39.1
N$159
  Top 0.305: U$14.P3 84.45,8.89 88.27,8.89 88.27,12.06 92.71,12.06 92.71,8.89 93.66,8.89 Q38.1
N$160
  Top 0.305: U$14.P4 87.63,9.87 87.63,12.7 96.2,12.7 Q37.1
N$161
  Top 0.305: Q36.1 99.06,7.35 R7.2
N$162
  Top 0.305: U$15.P1 87,40.3 87,37.47 97.16,37.47 97.16,41.91 96.84,41.91 Q35.1
N$163
  Top 0.305: U$15.P2 84.45,41.27 87.63,41.27 87.63,38.1 93.34,38.1 93.34,39.37 94.3,39.37 Q34.1
N$164
  Top 0.305: U$15.P3 83.19,41.91 88.27,41.91 88.27,38.73 92.08,38.73 92.08,41.91 91.76,41.91 Q33.1
N$165
  Top 0.305: U$15.P4 81.92,42.55 89.22,42.55 Q32.1
N$166
  Top 0.305: Q31.1 84.72,43.45 R8.2
N$167
  Top 0.305: U$16.P1 109.22,6.35 115.25,6.35 Q50.1
N$168
  Top 0.305: U$16.P2 110.49,8.26 115.57,8.26 115.57,10.16 117.79,10.16 Q49.1
N$169
  Top 0.305: U$16.P3 111.76,8.89 114.94,8.89 114.94,12.06 119.38,12.06 119.38,8.89 120.33,8.89 Q48.1
N$170
  Top 0.305: U$16.P4 114.3,9.87 114.3,12.7 122.87,12.7 Q47.1
N$171
  Top 0.305: Q46.1 R9.2
N$172
  Top 0.254: R10.2 113.35,41.54 Q45.1
N$177
  Top 0.305: U$18.P1 133.35,6.35 139.38,6.35 Q60.1
N$178
  Top 0.305: U$18.P2 134.62,8.26 139.7,8.26 139.7,10.16 141.92,10.16 Q59.1
N$179
  Top 0.305: U$18.P3 135.89,8.89 139.06,8.89 139.06,12.06 143.51,12.06 143.51,8.89 144.46,8.89 Q58.1
N$180
  Top 0.305: U$18.P4 138.43,9.87 138.43,12.7 147,12.7 Q57.1
N$181
  Top 0.305: Q56.1 149.86,7.35 R11.2
N$182
  Top 0.305: U$19.P1 137.8,40.3 137.8,37.47 147.96,37.47 147.96,41.91 147.64,41.91 Q55.1
N$183
  Top 0.305: U$19.P2 135.25,41.27 138.43,41.27 138.43,38.1 144.15,38.1 144.15,39.37 145.1,39.37 Q54.1
N$184
  Top 0.305: U$19.P3 133.99,41.91 139.06,41.91 139.06,38.73 142.88,38.73 142.88,41.91 142.56,41.91 Q53.1
N$185
  Top 0.305: U$19.P4 132.72,42.55 140.02,42.55 Q52.1
N$186
  Top 0.305: Q51.1 135.52,43.45 R12.2
N$187
  Top 0.254: J1.4 17.14,27.94 IC1.14
N$198
  Top 0.254: J3.3 Q48.3
N$199
  Top 0.254: J3.4 Q49.3
N$200
  Top 0.254: J3.5 Q50.3
N$221
  Top 0.254: Q51.3 J6.1
N$222
  Top 0.254: J6.2 Q52.3
N$223
  Top 0.254: Q53.3 J6.3
N$224
  Top 0.254: J6.4 Q54.3
N$225
  Top 0.254: Q55.3 J6.5
N$226
  Top 0.254: Q56.3 J5.1
N$227
  Top 0.254: J5.2 Q57.3
N$228
  Top 0.254: Q58.3 J5.3
N$229
  Top 0.254: J5.4 Q59.3
N$230
  Top 0.254: J5.5 Q60.3
RCK  (via drill 0.3)
  Top 0.254: v19.68,20.32 IC1.12 | v29.84,20.32 IC3.12 | v133.99,20.32 IC5.12 | v67.63,20.32 67.95,20.32 IC2.12 | IC4.12 v83.19,20.32 | IC9.12 117.48,20.32 v117.16,20.32
  Bottom 0.254: J1.1 v19.68,20.32 v29.84,20.32 v67.63,20.32 v83.19,20.32 v117.16,20.32 v133.99,20.32
SCK  (via drill 0.3)
  Top 0.254: v20.95,25.4 IC1.11 | v28.57,25.4 IC3.11 | v132.72,25.4 IC5.11 | v69.85,25.4 69.22,25.4 IC2.11 | IC4.11 v81.92,25.4 | IC9.11 118.75,25.4 v119.7,25.4
  Bottom 0.254: J1.3 v20.95,25.4 v28.57,25.4 v69.85,25.4 v81.92,25.4 v119.7,25.4 v132.72,25.4
SCL  (via drill 0.3)
  Top 0.254: v22.22,21.91 IC1.10 | v27.3,21.91 IC3.10 | v131.44,21.91 IC5.10 | v80.58,21.91 80.58,28.68 IC4.10 | IC2.10 v70.48,21.91 | IC9.10 v120.02,21.91
  Bottom 0.254: J1.2 22.22,22.86 v22.22,21.91 v27.3,21.91 v70.48,21.91 v80.58,21.91 v120.02,21.91 v131.44,21.91